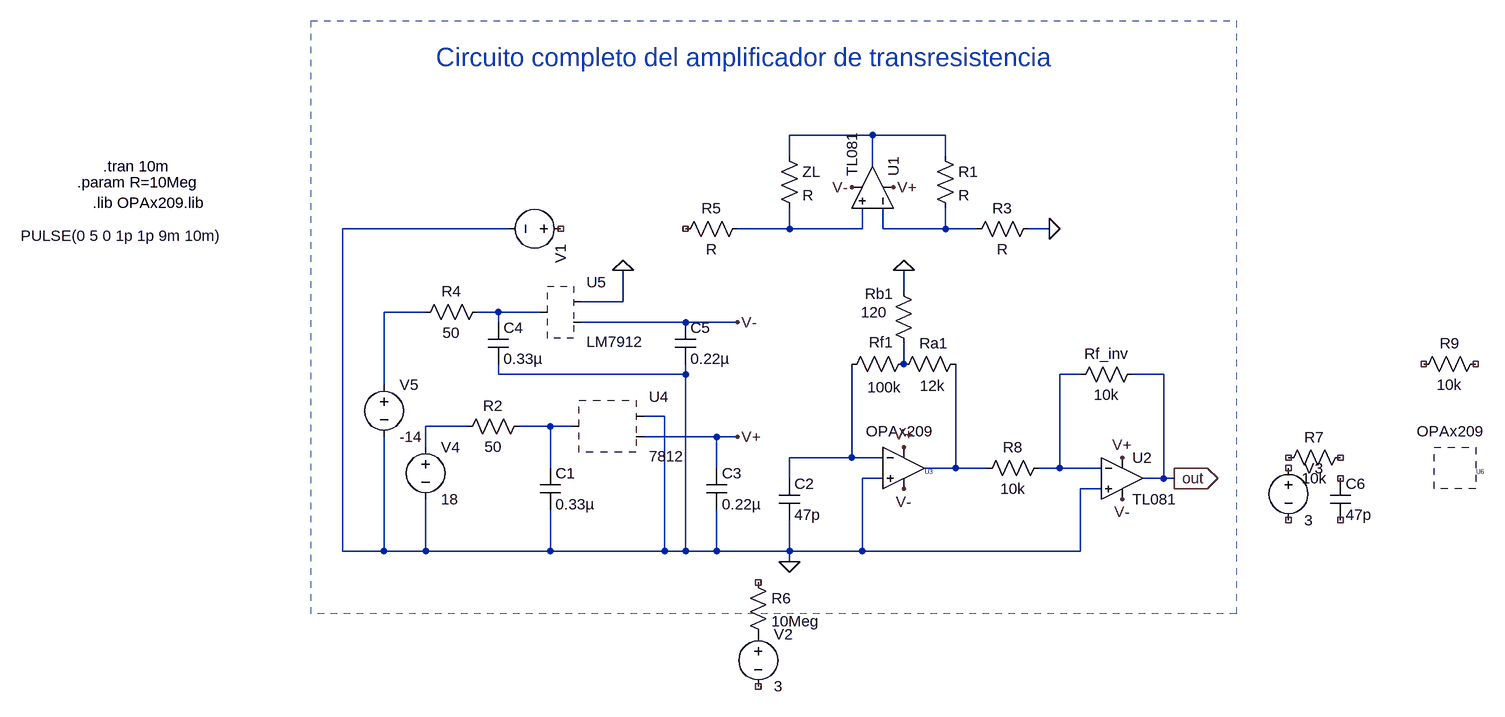
[diagram p0: schematic amplifier.asc]
amplifier.asc, the LTspice schematic file:
Version 4
SHEET 1 2156 740
WIRE 880 -384 752 -384
WIRE 992 -384 880 -384
WIRE 752 -352 752 -384
WIRE 992 -352 992 -384
WIRE 880 -336 880 -384
WIRE 320 -240 64 -240
WIRE 752 -240 752 -272
WIRE 752 -240 672 -240
WIRE 864 -240 864 -272
WIRE 864 -240 752 -240
WIRE 896 -240 896 -272
WIRE 992 -240 992 -272
WIRE 992 -240 896 -240
WIRE 1040 -240 992 -240
WIRE 1152 -240 1120 -240
WIRE 928 -144 928 -176
WIRE 464 -128 432 -128
WIRE 496 -128 496 -176
WIRE 496 -128 464 -128
WIRE 192 -112 128 -112
WIRE 304 -112 272 -112
WIRE 352 -112 304 -112
WIRE 368 -112 352 -112
WIRE 304 -96 304 -112
WIRE 464 -96 432 -96
WIRE 592 -96 464 -96
WIRE 672 -96 592 -96
WIRE 928 -32 928 -64
WIRE 304 -16 304 -32
WIRE 592 -16 592 -32
WIRE 592 -16 304 -16
WIRE 1200 -16 1168 -16
WIRE 1328 -16 1280 -16
WIRE 128 0 128 -112
WIRE 560 48 528 48
WIRE 256 64 192 64
WIRE 384 64 336 64
WIRE 416 64 384 64
WIRE 640 80 528 80
WIRE 672 80 640 80
WIRE 192 96 192 64
WIRE 848 112 848 -32
WIRE 848 112 752 112
WIRE 896 112 848 112
WIRE 384 128 384 64
WIRE 640 128 640 80
WIRE 1008 128 1008 -32
WIRE 1008 128 960 128
WIRE 1056 128 1008 128
WIRE 1168 128 1168 -16
WIRE 1168 128 1136 128
WIRE 1232 128 1168 128
WIRE 752 144 752 112
WIRE 896 144 864 144
WIRE 1328 144 1328 -16
WIRE 1328 144 1296 144
WIRE 1344 144 1328 144
WIRE 1232 160 1200 160
WIRE 64 256 64 -240
WIRE 128 256 128 80
WIRE 128 256 64 256
WIRE 192 256 192 176
WIRE 192 256 128 256
WIRE 384 256 384 192
WIRE 384 256 192 256
WIRE 560 256 560 48
WIRE 560 256 384 256
WIRE 592 256 592 -16
WIRE 592 256 560 256
WIRE 640 256 640 192
WIRE 640 256 592 256
WIRE 752 256 752 208
WIRE 752 256 640 256
WIRE 864 256 864 144
WIRE 864 256 752 256
WIRE 1200 256 1200 160
WIRE 1200 256 864 256
WIRE 752 272 752 256
FLAG 1152 -240 0
FLAG 1344 144 out
IOPIN 1344 144 Out
FLAG 752 272 0
FLAG 672 80 V+
FLAG 672 -96 V-
FLAG 928 96 V+
FLAG 1264 112 V+
FLAG 912 -304 V+
FLAG 848 -304 V-
FLAG 928 160 V-
FLAG 1264 176 V-
FLAG 496 -176 0
FLAG 928 -176 0
SYMBOL AutoGenerated\\TL081 880 -304 M270
SYMATTR InstName U1
SYMATTR Value TL081
SYMBOL res 976 -368 R0
SYMATTR InstName R1
SYMBOL res 736 -368 R0
SYMATTR InstName ZL
SYMBOL res 1024 -224 R270
WINDOW 0 32 56 VTop 2
WINDOW 3 0 56 VBottom 2
SYMATTR InstName R3
SYMBOL res 688 -256 R90
WINDOW 0 0 56 VBottom 2
WINDOW 3 32 56 VTop 2
SYMATTR InstName R5
SYMBOL voltage 416 -240 R90
WINDOW 123 0 0 Left 0
WINDOW 39 0 0 Left 0
WINDOW 3 11 847 VLeft 2
SYMATTR Value PULSE(0 5 0 1p 1p 9m 10m)
SYMATTR InstName V1
SYMBOL cap 736 144 R0
SYMATTR InstName C2
SYMATTR Value 47p
SYMBOL AutoGenerated\\TL081 928 128 R0
WINDOW 0 39 12 Bottom 0
WINDOW 3 -7 -72 Top 2
SYMATTR InstName U3
SYMATTR Value OPAx209
SYMBOL AutoGenerated\\TL081 1264 144 R0
SYMATTR InstName U2
SYMATTR SpiceModel TL081
SYMATTR Value TL081
SYMBOL res 1152 112 R90
WINDOW 0 0 56 VBottom 2
WINDOW 3 32 56 VTop 2
SYMATTR InstName R8
SYMATTR Value 10k
SYMBOL res 1296 -32 R90
WINDOW 0 0 56 VBottom 2
WINDOW 3 32 56 VTop 2
SYMATTR InstName Rf_inv
SYMATTR Value 10k
SYMBOL AutoGenerated\\7812 464 64 R0
SYMATTR InstName U4
SYMBOL voltage 192 80 R0
WINDOW 123 0 0 Left 0
WINDOW 39 0 0 Left 0
SYMATTR InstName V4
SYMATTR Value 18
SYMBOL AutoGenerated\\LM7912 400 -112 R0
SYMATTR InstName U5
SYMBOL res 352 48 R90
WINDOW 0 0 56 VBottom 2
WINDOW 3 32 56 VTop 2
SYMATTR InstName R2
SYMATTR Value 50
SYMBOL cap 368 128 R0
SYMATTR InstName C1
SYMATTR Value 0.33µ
SYMBOL cap 624 128 R0
SYMATTR InstName C3
SYMATTR Value 0.22µ
SYMBOL res 288 -128 R90
WINDOW 0 0 56 VBottom 2
WINDOW 3 32 56 VTop 2
SYMATTR InstName R4
SYMATTR Value 50
SYMBOL voltage 128 -16 R0
WINDOW 123 0 0 Left 0
WINDOW 39 0 0 Left 0
SYMATTR InstName V5
SYMATTR Value -14
SYMBOL cap 288 -96 R0
SYMATTR InstName C4
SYMATTR Value 0.33µ
SYMBOL cap 576 -96 R0
SYMATTR InstName C5
SYMATTR Value 0.22µ
SYMBOL res 944 -48 R90
WINDOW 0 -2 51 VBottom 2
WINDOW 3 36 46 VTop 2
SYMATTR InstName Rf1
SYMATTR Value 100k
SYMBOL res 1024 -48 R90
WINDOW 0 0 50 VBottom 2
WINDOW 3 34 52 VTop 2
SYMATTR InstName Ra1
SYMATTR Value 12k
SYMBOL res 912 -160 R0
WINDOW 0 -44 20 Left 2
WINDOW 3 -50 48 Left 2
SYMATTR InstName Rb1
SYMATTR Value 120
SYMBOL res 688 288 R0
SYMATTR InstName R6
SYMATTR Value 10Meg
SYMBOL voltage 704 368 R0
WINDOW 123 0 0 Left 0
WINDOW 39 0 0 Left 0
SYMATTR InstName V2
SYMATTR Value 3
SYMBOL AutoGenerated\\TL081 1776 128 R0
WINDOW 0 39 12 Bottom 0
WINDOW 3 -7 -72 Top 2
SYMATTR InstName U6
SYMATTR Value OPAx209
SYMBOL cap 1584 144 R0
SYMATTR InstName C6
SYMATTR Value 47p
SYMBOL res 1616 96 R90
WINDOW 0 0 56 VBottom 2
WINDOW 3 32 56 VTop 2
SYMATTR InstName R7
SYMATTR Value 10k
SYMBOL voltage 1520 112 R0
WINDOW 123 0 0 Left 0
WINDOW 39 0 0 Left 0
SYMATTR InstName V3
SYMATTR Value 3
SYMBOL res 1824 -48 R90
WINDOW 0 0 56 VBottom 2
WINDOW 3 32 56 VTop 2
SYMATTR InstName R9
SYMATTR Value 10k
TEXT -344 -312 Left 2 !.param R=10Meg
TEXT -304 -336 Left 2 !.tran 10m
TEXT -320 -280 Left 2 !.lib OPAx209.lib
TEXT 208 -504 Left 4 ;Circuito completo del amplificador de transresistencia
RECTANGLE Normal 1440 352 16 -560 2

The netlist it stands for:
* amplifier.asc
* U1: TL081 (symbol AutoGenerated\TL081 not available, pins judged from their places): In+=N002 In-=N003 V+=V+ V-=V- OUT=N001
R1 N001 N003 R
R§ZL N001 N002 R
R3 N003 0 R
R5 N002 NC_01 R
V1 NC_02 0 PULSE(0 5 0 1p 1p 9m 10m)
C2 N010 0 47p
* U3: OPAx209 (symbol AutoGenerated\TL081 not available, pins judged from their places): In+=0 In-=N010 V+=V+ V-=V- OUT=N011
* U2: TL081 TL081 (symbol AutoGenerated\TL081 not available, pins judged from their places): In+=0 In-=N007 V+=V+ V-=V- OUT=out
R8 N007 N011 10k
Rf_inv out N007 10k
* U4: 7812 (symbol AutoGenerated\7812 not available, pin order unknown); nets seen at it: 0, N009, V+
V4 N008 0 18
* U5: LM7912 (symbol AutoGenerated\LM7912 not available, pin order unknown); nets seen at it: 0, N005, V-
R2 N009 N008 50
C1 N009 0 0.33µ
C3 V+ 0 0.22µ
R4 N005 N004 50
V5 N004 0 -14
C4 N005 0 0.33µ
C5 V- 0 0.22µ
Rf1 N006 N010 100k
Ra1 N011 N006 12k
Rb1 0 N006 120
R6 NC_03 P001 10Meg
V2 P001 NC_04 3
* U6: OPAx209 (symbol AutoGenerated\TL081 not available, pin order unknown); nets seen at it: 
C6 NC_05 NC_06 47p
R7 NC_07 NC_08 10k
V3 NC_09 NC_10 3
R9 NC_11 NC_12 10k
.param R=10Meg
.tran 10m
.lib OPAx209.lib
* Circuito completo del amplificador de transresistencia
.backanno
.end